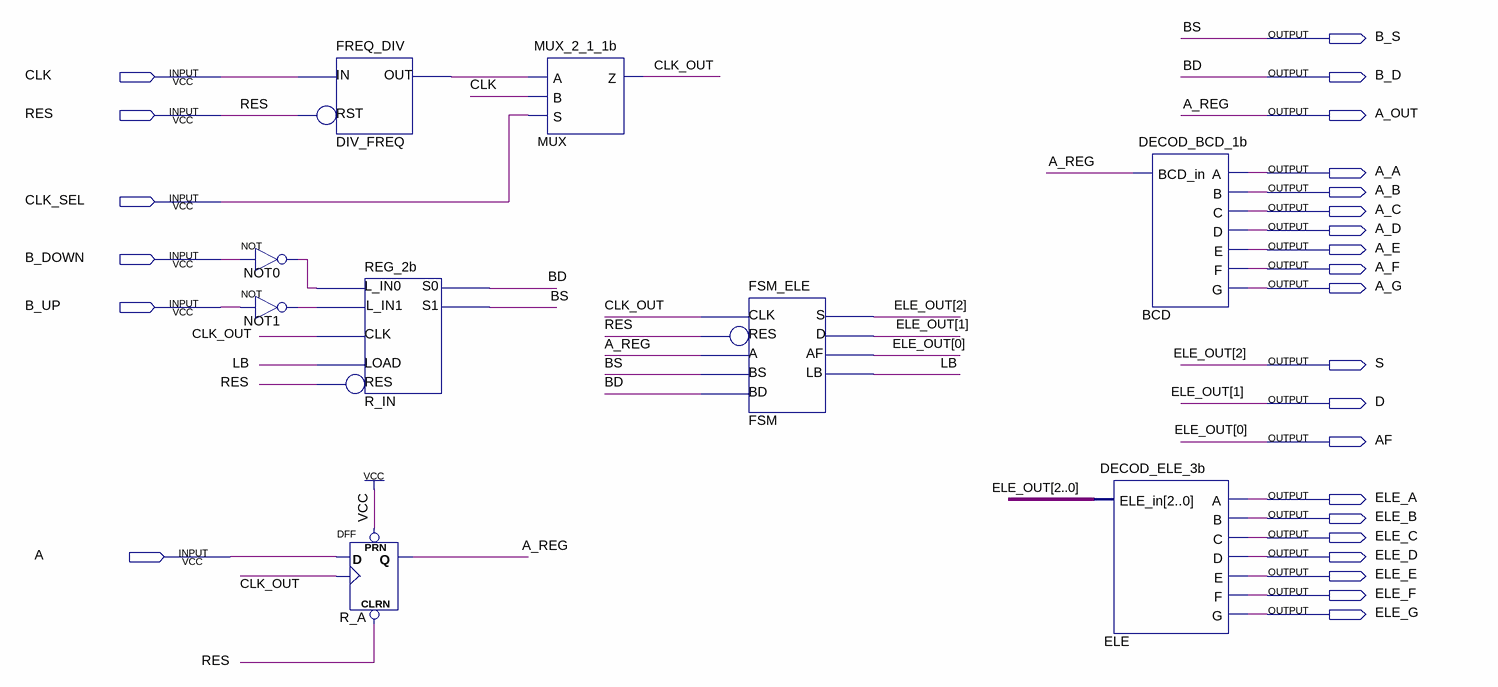
[diagram p0: schematic sheet]
// Quartus schematic ELEVADOR.bdf as structural Verilog: 9 symbols, 26 pins
module ELEVADOR (
  input  CLK,
  input  RES,
  input  CLK_SEL,
  input  B_DOWN,
  input  B_UP,
  input  A,
  output B_S,
  output B_D,
  output A_OUT,
  output A_A,
  output A_B,
  output A_C,
  output A_D,
  output A_E,
  output A_F,
  output A_G,
  output S,
  output D,
  output AF,
  output ELE_A,
  output ELE_B,
  output ELE_C,
  output ELE_D,
  output ELE_E,
  output ELE_F,
  output ELE_G
);

  wire CLK_OUT, DIV_FREQ_out, LB, NOT0_out, NOT1_out;

  not NOT0 (NOT0_out, B_DOWN);
  not NOT1 (NOT1_out, B_UP);
  FREQ_DIV DIV_FREQ (.IN(CLK), .RST(RES), .OUT(DIV_FREQ_out));
  REG_2b R_IN (.L_IN0(NOT0_out), .L_IN1(NOT1_out), .LOAD(LB), .CLK(CLK_OUT), .RES(RES), .S0(B_D), .S1(B_S));
  DFF R_A (.CLRN(RES), .CLK(CLK_OUT), .D(A), .PRN(1'b1), .Q(A_OUT));
  MUX_2_1_1b MUX (.A(DIV_FREQ_out), .B(CLK), .S(CLK_SEL), .Z(CLK_OUT));
  FSM_ELE FSM (.CLK(CLK_OUT), .RES(RES), .A(A_OUT), .BS(B_S), .BD(B_D), .S(S), .D(D), .AF(AF), .LB(LB));
  DECOD_BCD_1b BCD (.BCD_in(A_OUT), .A(A_A), .B(A_B), .C(A_C), .D(A_D), .E(A_E), .F(A_F), .G(A_G));
  DECOD_ELE_3b ELE (.ELE_in({S, D, AF}), .A(ELE_A), .B(ELE_B), .C(ELE_C), .D(ELE_D), .E(ELE_E), .F(ELE_F), .G(ELE_G));

  // Other names for the same wires on the sheet: A_REG = A_OUT; BD = B_D; BS = B_S; ELE_OUT[2:0] = {S, D, AF}
endmodule
